# EAGLE design RasPi_adapt (EAGLE 6.4)
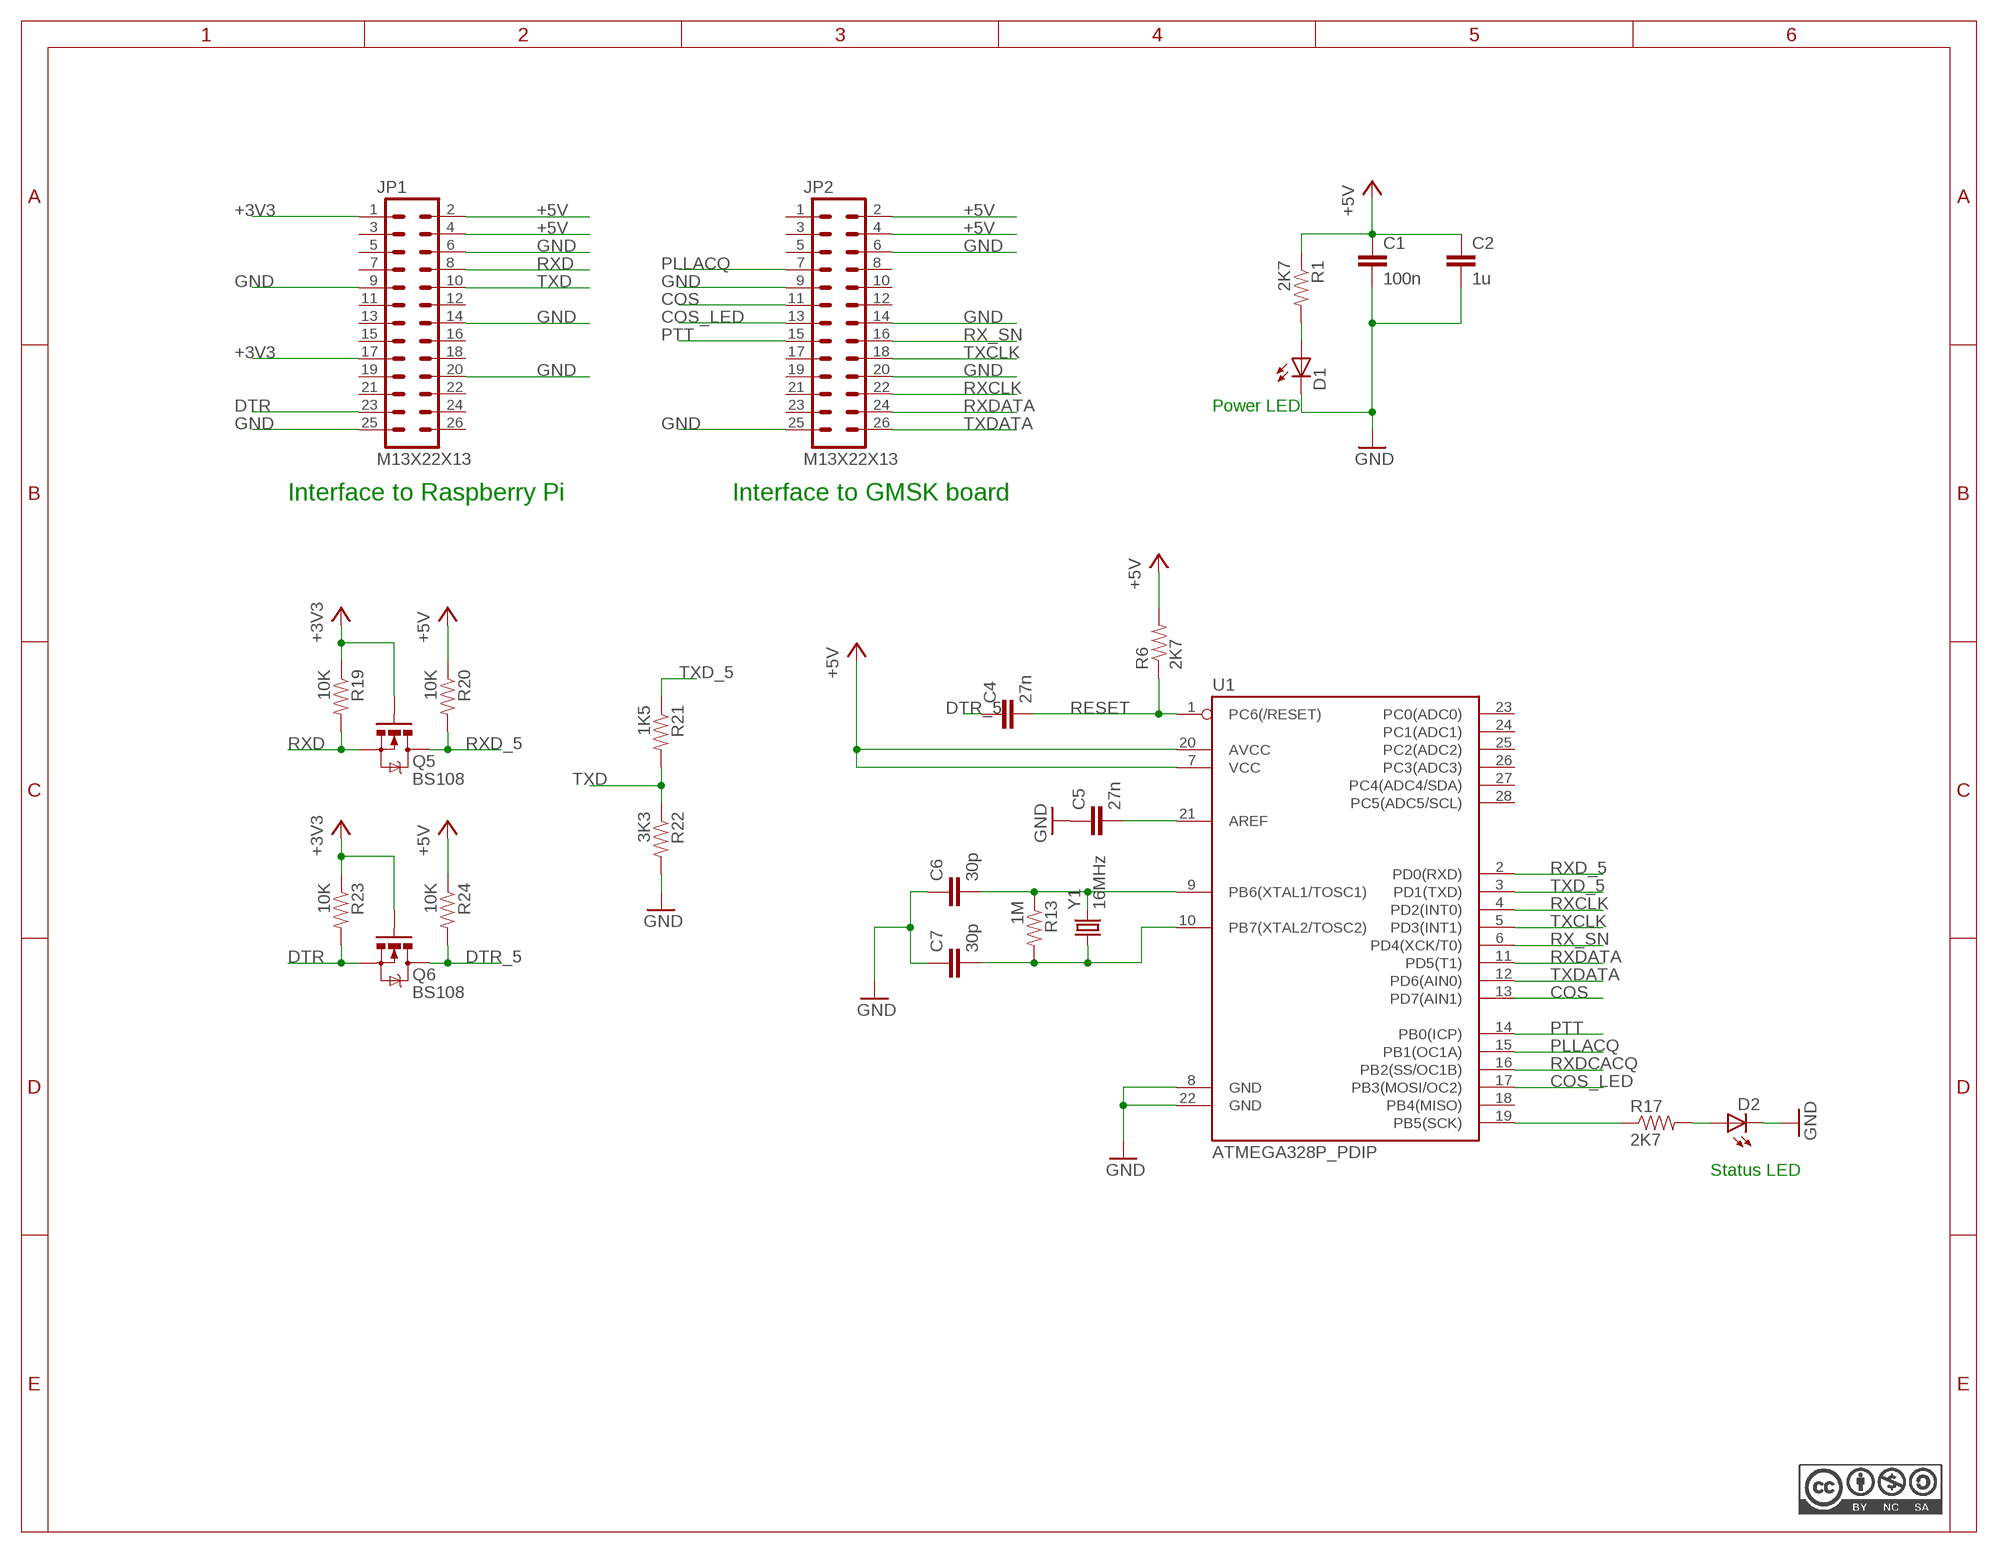
[diagram p0: schematic, sheet 1]

## Parts
C1  100n  CAPEZ  [CAP-PTH-SMALLEZ]
C2  1u  CAPEZ  [CAP-PTH-SMALLEZ]
C4  27n  CAPEZ  [CAP-PTH-SMALLEZ]
C5  27n  CAPEZ  [CAP-PTH-SMALLEZ]
C6  30p  CAPEZ  [CAP-PTH-SMALLEZ]
C7  30p  CAPEZ  [CAP-PTH-SMALLEZ]
D1  LED3MM  [LED3MM]
D2  LED3MM  [LED3MM]
JP1  M13X22X13  [2X13]
JP2  M13X22X13  [2X13]
Q5  BS108  MOSFET-NCHANNELBS170  [TO-92]
Q6  BS108  MOSFET-NCHANNELBS170  [TO-92]
R1  2K7  RESISTOREZ  [AXIAL-0.3EZ]
R6  2K7  RESISTOREZ  [AXIAL-0.3EZ]
R13  1M  RESISTOREZ  [AXIAL-0.3EZ]
R17  2K7  RESISTOREZ  [AXIAL-0.3EZ]
R19  10K  RESISTOREZ  [AXIAL-0.3EZ]
R20  10K  RESISTOREZ  [AXIAL-0.3EZ]
R21  1K5  RESISTOREZ  [AXIAL-0.3EZ]
R22  3K3  RESISTOREZ  [AXIAL-0.3EZ]
R23  10K  RESISTOREZ  [AXIAL-0.3EZ]
R24  10K  RESISTOREZ  [AXIAL-0.3EZ]
U1  ATMEGA328P_PDIP  [DIL28-3]
Y1  16MHz  CRYSTAL_CRYSTALHC49S  [CRYSTAL_HC49/S]

## Nets
+3V3 [pwr]: JP1.1 JP1.17 Q5.2(G) Q6.2(G) R19.P$1 R23.P$1
+5V [pwr]: C1.1 C2.1 JP1.2 JP1.4 JP2.2 JP2.4 R1.P$1 R6.P$2 R20.P$1 R24.P$1 U1.7(VCC) U1.20(AVCC)
COS: JP2.11 U1.13(PD7(AIN1))
COS_LED: JP2.13 U1.17(PB3(MOSI/OC2))
DTR: JP1.23 Q6.3(S) R23.P$2
DTR_5: C4.1 Q6.1(D) R24.P$2
GND [pwr]: C1.2 C2.2 C5.1 C6.1 C7.1 D1.K(C) D2.K(C) JP1.6 JP1.9 JP1.14 JP1.20 JP1.25 JP2.6 JP2.9 JP2.14 JP2.20 JP2.25 R22.P$2 U1.8(GND) U1.22(GND)
N$1: R17.P$1 U1.19(PB5(SCK))
N$2: D1.A R1.P$2
N$3: D2.A R17.P$2
N$8: C7.2 R13.P$2 U1.10(PB7(XTAL2/TOSC2)) Y1.1
N$13: C6.2 R13.P$1 U1.9(PB6(XTAL1/TOSC1)) Y1.2
N$31: C5.2 U1.21(AREF)
PLLACQ: JP2.7 U1.15(PB1(OC1A))
PTT: JP2.15 U1.14(PB0(ICP))
RESET: C4.2 R6.P$1 U1.1(PC6(/RESET))
RX_SN: JP2.16 U1.6(PD4(XCK/T0))
RXCLK: JP2.22 U1.4(PD2(INT0))
RXD: JP1.8 Q5.3(S) R19.P$2
RXD_5: Q5.1(D) R20.P$2 U1.2(PD0(RXD))
RXDATA: JP2.24 U1.11(PD5(T1))
RXDCACQ: U1.16(PB2(SS/OC1B))
TXCLK: JP2.18 U1.5(PD3(INT1))
TXD: JP1.10 R21.P$2 R22.P$1
TXD_5: R21.P$1 U1.3(PD1(TXD))
TXDATA: JP2.26 U1.12(PD6(AIN0))
Unconnected: JP1.3 JP1.5 JP1.7 JP1.11 JP1.12 JP1.13 JP1.15 JP1.16 JP1.18 JP1.19 JP1.21 JP1.22 JP1.24 JP1.26 JP2.1 JP2.3 JP2.5 JP2.8 JP2.10 JP2.12 JP2.17 JP2.19 JP2.21 JP2.23 U1.18(PB4(MISO)) U1.23(PC0(ADC0)) U1.24(PC1(ADC1)) U1.25(PC2(ADC2)) U1.26(PC3(ADC3)) U1.27(PC4(ADC4/SDA)) U1.28(PC5(ADC5/SCL))

## Notes on the sheet
- Power LED
- Interface to Raspberry Pi | Interface to GMSK board
- Status LED

## Library data of the parts
C1 C2 C4-C7 = SparkFun-Capacitors:CAP: Capacitor Standard 0603 ceramic capacitor, and 0.1" leaded capacitor.
D1 D2 = SparkFun-LED:LED: LEDs Standard schematic elements and footprints for 5mm, 3mm, 1206, and 0603 sized LEDs. 5mm - Spark Fun Electronics SKU : COM-00529 (and others)
JP1 JP2 = SparkFun-Connectors:M13X2: 0.1" spaced headers
Q5 Q6 = SparkFun-DiscreteSemi:MOSFET-NCHANNEL: Common NMOSFET Parts MFG P/N Store ID Prod ID FDD8780 TRANS-09984 SI7820DN TRANS-11055 FDS6630A IC-08089 2N7002PW TRANS-11151 FQP30N06L COM-10213 TRANS-10060 BSS123LT1G TRANS-08345 BSS138 TRANS-00830 BS170 2N7000
R1 R6 R13 R17 R19-R24 = SparkFun-Resistors:RESISTOR: Resistor Basic schematic elements and footprints for 0603, 1206, and PTH resistors.
U1 = SparkFun-DigitalIC:ATMEGA328P_PDIP: uC used in the Arduino 32kb flash, 1k EEPROM, 2k SRAM This is the through-hole version of this chip.
Y1 = AIS_Mk2:CRYSTAL_CRYSTAL: CRYSTAL

## Net classes
1 pwr: width 0.381 mm

## Board
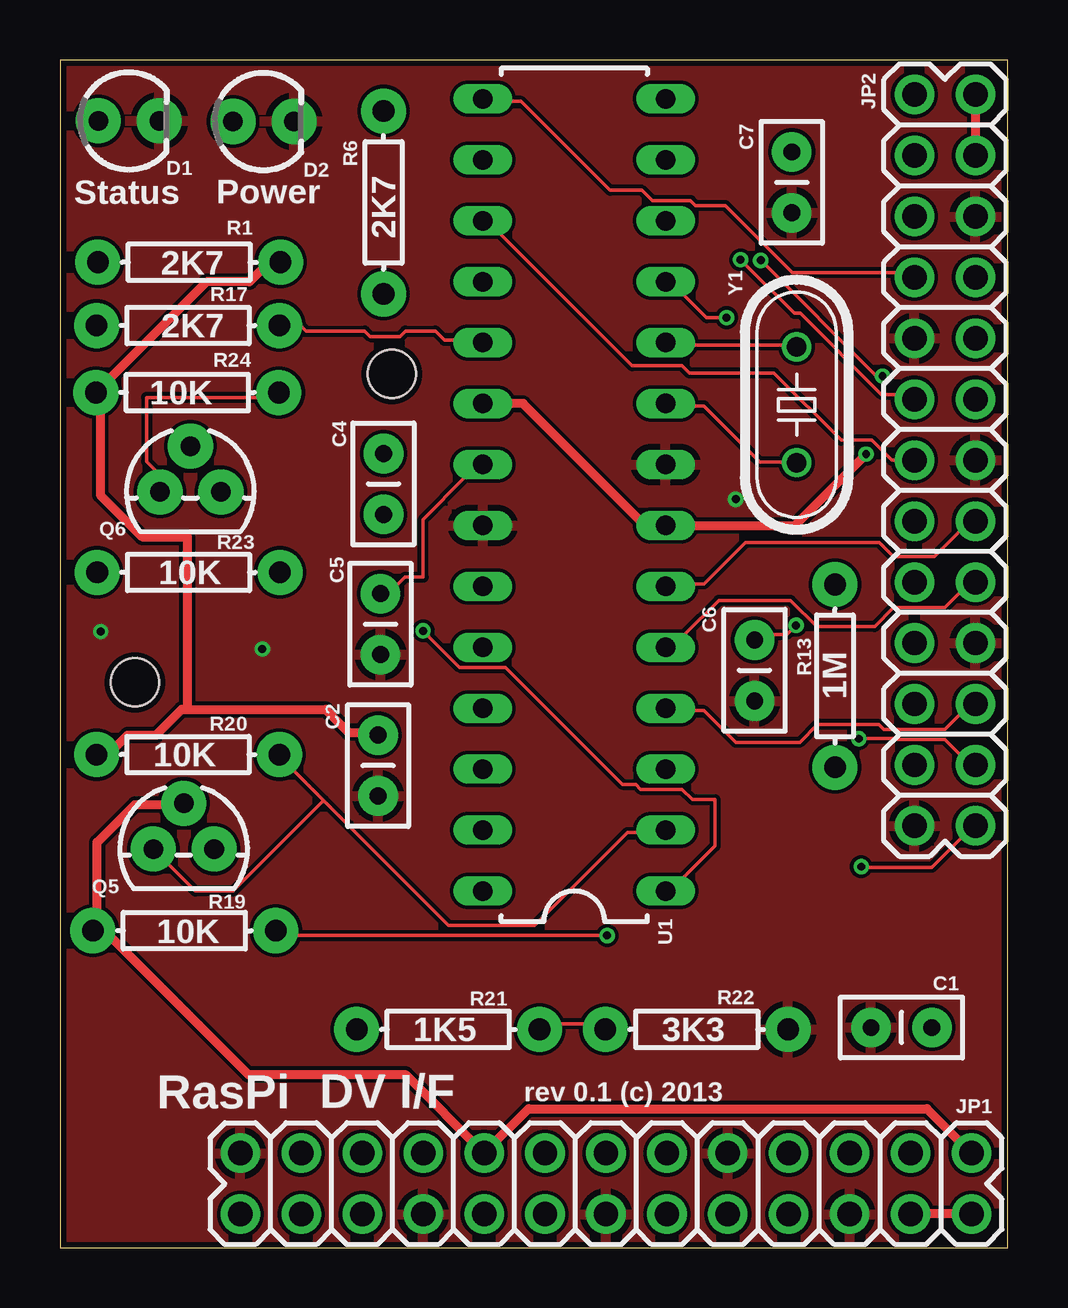
[diagram p1: board, top side]
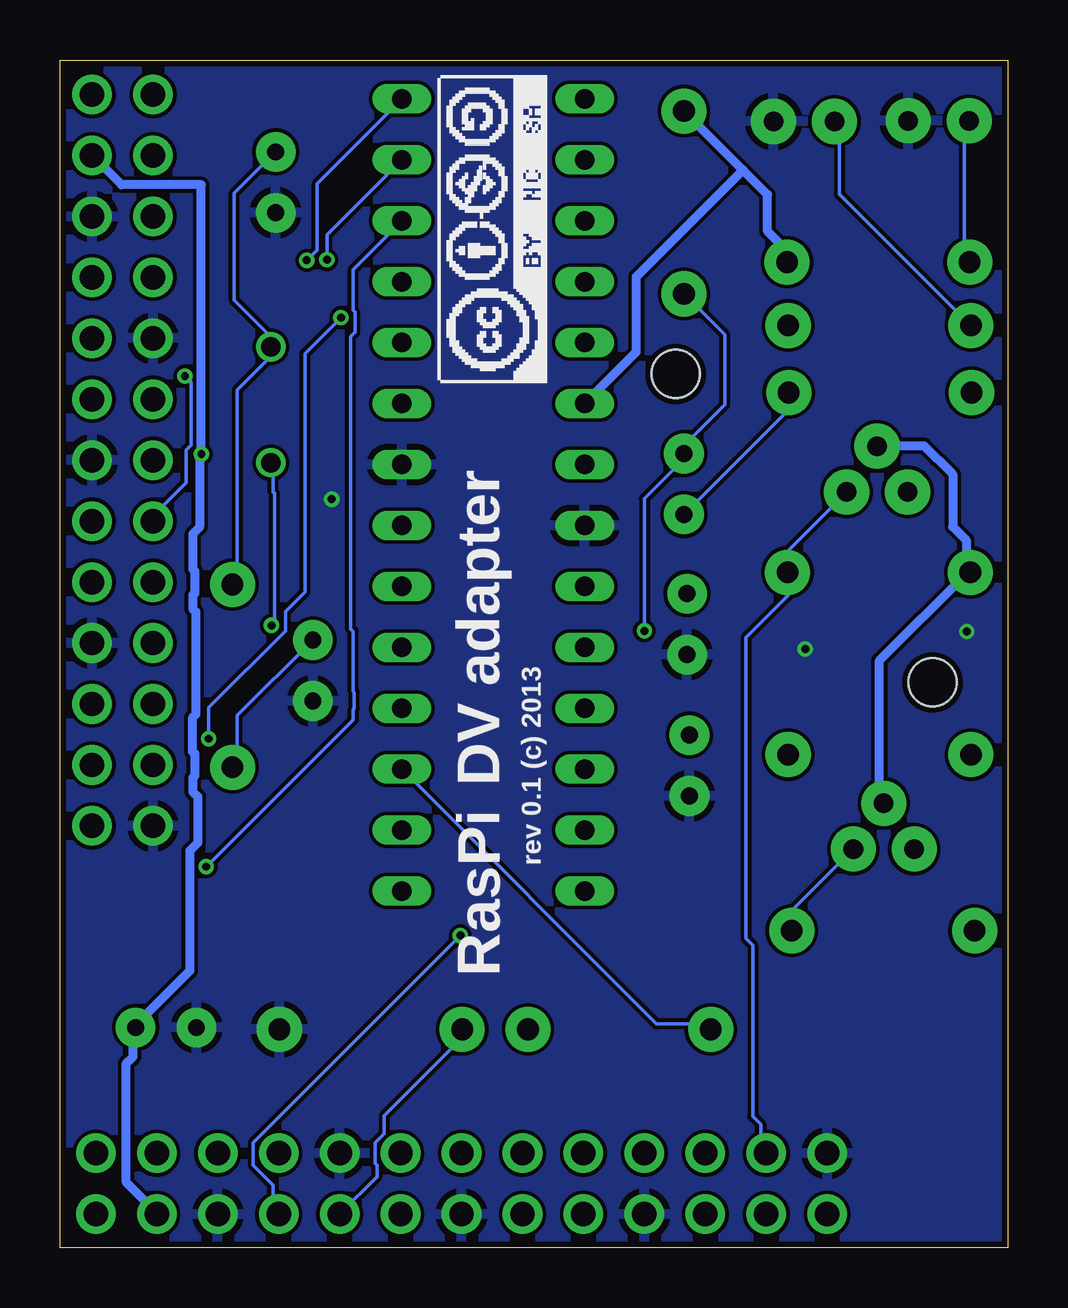
[diagram p2: board, bottom side, seen from below]

Size 39.5 x 49.5 mm. Coordinates in mm from the lower left corner, seen from the top.
Outline: 0,0 39.5,0 39.5,49.5 0,49.5 0,0
Copper layers (1*2*15*16): Top 0.035mm / dielectric 0.2mm / layer 2 0.0175mm / dielectric 1.1mm / layer 15 0.0175mm / dielectric 0.2mm / Bottom 0.035mm
Design rules "SeeedStudio_DRU_no_angle_20130527": minimum track width 6mil, minimum drill 12mil, track to track 6mil, track to pad 6mil, pad to pad 6mil, via to via 6mil, smd to smd 0mil, copper to edge 10mil, drill to drill 10mil, minimum pad ring 6mil, minimum via ring 6mil, stop-mask expansion 2mil, vias tented up to drill 25mil, thermal gap 10mil
Holes 2 mm at 13.83,36.41 3.12,23.56

### Footprints (pad centres in the part's own frame; a part is rotated, then mirrored left to right if it is on the bottom)
CAP-PTH-SMALLEZ = drill 0.7 pad 1.651: 1 0,0; 2 2.54,0
LED3MM = drill 0.813 pad 1.88: A -1.27,0; K 1.27,0
2X13 = drill 1.016 pad 1.651: 1 0,0; 2 0,2.54; 3 2.54,0; 4 2.54,2.54; 5 5.08,0; 6 5.08,2.54; 7 7.62,0; 8 7.62,2.54; 9 10.16,0; 10 10.16,2.54; 11 12.7,0; 12 12.7,2.54; 13 15.24,0; 14 15.24,2.54; 15 17.78,0; 16 17.78,2.54; 17 20.32,0; 18 20.32,2.54; 19 22.86,0; 20 22.86,2.54; 21 25.4,0; 22 25.4,2.54; 23 27.94,0; 24 27.94,2.54; 25 30.48,0; 26 30.48,2.54
TO-92 = drill 0.813 pad 1.88: 1 -1.27,0; 2 0,1.905; 3 1.27,0
AXIAL-0.3EZ = drill 0.9 pad 1.88: P$1 -3.81,0; P$2 3.81,0
DIL28-3 = drill 0.813 long: 1 -16.51,-3.81; 2 -13.97,-3.81; 3 -11.43,-3.81; 4 -8.89,-3.81; 5 -6.35,-3.81; 6 -3.81,-3.81; 7 -1.27,-3.81; 8 1.27,-3.81; 9 3.81,-3.81; 10 6.35,-3.81; 11 8.89,-3.81; 12 11.43,-3.81; 13 13.97,-3.81; 14 16.51,-3.81; 15 16.51,3.81; 16 13.97,3.81; 17 11.43,3.81; 18 8.89,3.81; 19 6.35,3.81; 20 3.81,3.81; 21 1.27,3.81; 22 -1.27,3.81; 23 -3.81,3.81; 24 -6.35,3.81; 25 -8.89,3.81; 26 -11.43,3.81; 27 -13.97,3.81; 28 -16.51,3.81
CRYSTAL_HC49/S = drill 0.813: 1 -2.413,0; 2 2.413,0

### Placement (x,y rotation side)
C1  36.35,9.17 180 top
C2  13.26,21.36 270 top
C4  13.49,30.56 90 top
C5  13.36,24.71 90 top
C6  28.96,22.78 90 top
C7  30.51,43.13 90 top
D1  2.87,46.96 0 top
D2  8.48,46.94 0 top
JP1  38,3.93 180 top
JP2  35.62,48.06 270 top
Q5  5.16,16.61 0 top
Q6  5.44,31.5 0 top
R1  5.39,41.07 180 top
R6  13.49,43.56 90 top
R13  32.31,23.83 90 top
R17  5.34,38.43 180 top
R19  5.18,13.21 0 top
R20  5.34,20.55 0 top
R21  16.18,9.09 0 top
R22  26.54,9.09 0 top
R23  5.36,28.14 0 top
R24  5.31,35.64 0 top
U1  21.44,31.37 90 top
Y1  30.71,35.13 270 top

### Tracks (layer width: path | path; a pad name or v marks a point on that pad's centre or on a via)
+3V3
  Top 0.381: JP1.1 36.15,5.79 19.53,5.79 17.81,4.06 JP1.17 14.4,7.21 7.85,7.21 1.86,13.21 R19.P$1 1.55,13.39 1.55,16.89 3.12,18.47 5.11,18.47 Q5.2
  Bottom 0.381: Q6.2 5.44,33.43 3.48,33.43 2.29,32.23 2.29,30.05 1.73,29.49 1.73,28.32 R23.P$1 1.73,28.07 5.34,24.46 5.34,18.69 Q5.2
+5V  (via drill 0.33)
  Top 0.381: C2.1 13.16,21.46 12.04,21.46 11.07,22.43 5.31,22.43 | 5.31,22.43 5.08,22.43 4.01,21.36 2.82,21.36 2.01,20.55 R20.P$1 | R1.P$1 8.71,41.07 7.9,40.26 6.12,40.26 R24.P$1 1.58,35.46 1.68,35.46 1.68,31.37 3.43,29.62 5.31,29.62 5.31,22.43 | JP1.4 35.48,1.4 JP1.2 | JP2.4 JP2.2 | U1.20 19.3,35.18 24.38,30.1 U1.7 30.63,30.1 v33.6,33.07
  Bottom 0.381: 11.02,44.91 10.01,43.89 10.01,42.37 9.2,41.55 R1.P$1 | 11.02,44.91 R6.P$2 | JP1.4 35.48,1.4 35.48,1.47 36.73,2.72 36.73,7.67 36.45,7.95 36.45,9.07 C1.1 36.27,9.35 34.09,11.53 34.09,16.54 33.76,16.87 33.76,18.8 33.96,19 33.96,19.58 33.88,19.66 33.88,20.57 33.99,20.68 33.99,22.07 33.83,22.23 33.83,26.49 33.96,26.62 33.96,27.2 33.88,27.28 33.88,28.19 33.96,28.27 33.96,29.74 33.68,30.02 33.68,32.89 v33.6,33.07 33.6,44.3 36.93,44.3 JP2.4 | 11.02,44.91 15.47,40.46 15.47,37.34 U1.20
COS  (via drill 0.33)
  Top 0.152: v28.37,41.17 30.61,38.94 30.86,38.94 34.24,35.56 35.41,35.56 JP2.11
  Bottom 0.152: U1.13 28.37,42.22 v28.37,41.17
COS_LED
  Top 0.152: U1.17 18.16,42.27 18.34,42.27 23.85,36.75 25.93,36.75 26.24,36.45 29.77,36.45 32.56,33.66 33.83,33.66 34.67,32.82 JP2.13
DTR
  Bottom 0.152: JP1.23 10.09,3.94 10.29,4.14 10.29,5.13 10.62,5.46 10.62,12.6 10.9,12.88 10.9,25.43 9.17,27.15 R23.P$2 9.14,28.19 9.14,29.06 Q6.3
DTR_5
  Top 0.152: Q6.1 4.17,32.33 4.04,32.33 3.61,32.77 3.61,35.43 8.92,35.43 R24.P$2
  Bottom 0.152: C4.1 9.12,34.92 R24.P$2
GND  (via drill 0.33)
  other vias: 8.43,24.94 1.7,25.68 28.17,31.19
  pour Bottom: 0,49.5 39.5,49.5 39.5,0 0,0
  pour Top: 0,49.5 39.5,49.5 39.5,0 0,0
N$1
  Top 0.152: U1.19 17.53,37.82 16.03,37.82 15.65,38.2 14.4,38.2 14.17,37.97 12.93,37.97 12.7,38.2 10.26,38.2 10.03,38.43 R17.P$1
N$2
  Bottom 0.152: R1.P$2 1.8,41.3 1.8,46.76 D1.A
N$3
  Bottom 0.152: R17.P$2 7.01,43.92 7.01,46.74 D2.A
N$8
  Top 0.152: U1.10 25.35,37.62 30.63,37.62 Y1.1
  Bottom 0.152: C7.2 32.23,43.94 32.23,39.5 30.71,37.97 Y1.1 30.76,37.49 30.76,37.08 32.11,35.74 32.11,27.84 R13.P$2
N$13  (via drill 0.33)
  Top 0.152: U1.9 25.35,35.08 26.85,35.08 29.19,32.74 30.68,32.74 Y1.2 | v30.68,25.93 30.3,25.55 29.19,25.55 C6.2
  Bottom 0.152: C6.2 32.11,22.17 32.11,20.22 R13.P$1 | Y1.2 30.61,32.61 30.61,31.5 30.56,31.45 30.56,26.06 v30.68,25.93
N$31
  Top 0.152: U1.21 17.09,32.11 16.89,32.11 15.14,30.35 15.14,27.94 14.38,27.94 13.69,27.25 C5.2
PLLACQ
  Top 0.152: U1.15 17.73,47.78 19.23,47.78 22.94,44.07 24.26,44.07 24.69,43.64 26.29,43.64 26.49,43.43 27.74,43.43 30.53,40.64 35.41,40.64 JP2.7
PTT  (via drill 0.33)
  Top 0.152: v29.21,41.15 34.04,36.32 v34.29,36.32
  Bottom 0.152: U1.14 28.78,44.35 28.78,41.58 v29.21,41.15 | v34.29,36.32 34.04,36.07 34.04,33.45 34.24,33.25 34.24,31.88 35.61,30.5 JP2.15
RESET  (via drill 0.33)
  Top 0.152: U1.1 25.76,15.37 25.93,15.37 27.31,16.74 27.31,18.67 26.37,18.67 25.93,19.1 24.21,19.1 24,19.3 23.45,19.3 18.57,24.18 16.66,24.18 v15.14,25.7
  Bottom 0.152: v15.14,25.7 15.14,31.22 13.49,32.87 C4.2 13.44,33.15 13.44,33.48 11.79,35.13 11.79,38.05 R6.P$1
RX_SN
  Top 0.152: U1.6 25.35,27.66 26.85,27.66 28.58,29.39 34.16,29.39 34.75,28.8 36.45,28.8 37.92,30.28 JP2.16
RXCLK
  Top 0.152: U1.4 25.35,22.38 26.85,22.38 28.17,21.06 30.84,21.06 31.57,21.79 34.14,21.79 34.34,21.59 36.88,21.59 37.95,22.66 JP2.22
RXD  (via drill 0.33)
  Top 0.152: v22.81,13.01 9.2,13.01 R19.P$2
  Bottom 0.152: v22.81,13.01 31.45,4.37 31.45,3.43 30.61,2.59 30.61,1.6 30.41,1.4 JP1.8 | Q5.3 8.99,14.05 R19.P$2
RXD_5
  Top 0.152: U1.2 25.15,17.3 23.65,17.3 19.79,13.44 16.21,13.44 11,18.64 | 11,18.64 9.14,20.5 R20.P$2 | Q5.1 5.64,14.86 7.21,14.86 11,18.64
RXDATA  (via drill 0.33)
  Top 0.152: U1.11 25.78,39.73 25.98,39.73 26.95,38.76 v27.79,38.76 | v33.3,21.21 34.9,21.21 34.93,21.18 36.88,21.18 37.95,20.12 JP2.24
  Bottom 0.152: v27.79,38.76 29.29,37.26 29.29,27.33 30.1,26.52 30.1,25.7 33.3,22.5 v33.3,21.21
TXCLK
  Top 0.152: U1.5 25.76,25.53 26.01,25.53 27.46,26.98 30.46,26.98 31.55,25.88 33.96,25.88 34.75,26.67 36.88,26.67 37.95,27.74 JP2.18
TXD
  Top 0.152: R21.P$2 20.22,9.32 21.84,9.32 22.02,9.14 R22.P$1
  Bottom 0.152: R22.P$1 22.73,8.74 25.98,5.49 25.98,4.75 26.37,4.37 26.37,3.5 26.29,3.43 26.29,2.95 JP1.10
TXD_5
  Bottom 0.152: U1.3 14.63,9.32 12.37,9.32 R21.P$1
TXDATA  (via drill 0.33)
  Top 0.152: v33.4,15.88 33.43,15.85 36.35,15.85 38.08,17.58 JP2.26
  Bottom 0.152: U1.12 27.28,40.77 27.28,39.06 27.2,38.99 27.2,38.15 27.38,37.97 27.38,25.78 27.28,25.68 27.28,23.19 27.23,23.14 27.23,22.48 27.28,22.43 27.28,22 v33.4,15.88

### Text on the board
tNames: Power | Status | RasPi | DV I/F | rev 0.1 (c) 2013
bNames: DV adapter | rev 0.1 (c) 2013 | RasPi